# EAGLE design vusb_version (EAGLE 6.5.0)
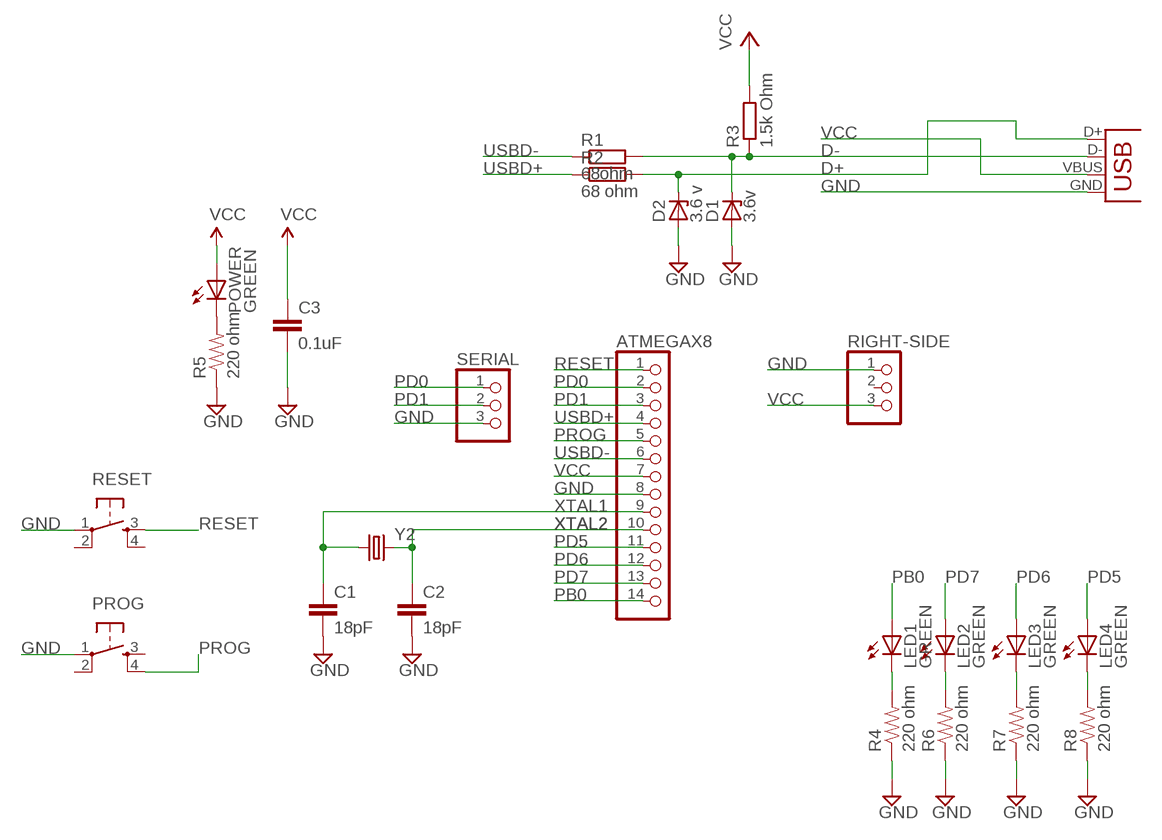
[diagram p0: schematic, sheet 1]

## Parts
ATMEGAX8  PINHD-1X14  [1X14]
C1  18pF  CAP1206  [1206]
C2  18pF  CAP1206  [1206]
C3  0.1uF  CAP1206  [1206]
D1  3.6v  ZENER-DIODESOT23  [SOT23]
D2  3.6 v  ZENER-DIODESOT23  [SOT23]
JP1  USBSMD  [USB-MINIB]
LED1  GREEN  LED-GREENLARGE  [LED-1206]
LED2  GREEN  LED-GREENLARGE  [LED-1206]
LED3  GREEN  LED-GREENLARGE  [LED-1206]
LED4  GREEN  LED-GREENLARGE  [LED-1206]
POWER  GREEN  LED-GREENLARGE  [LED-1206]
PROG  TAC_SWITCHPTH  [TACTILE-PTH]
R1  68ohm  R-EU_R0805  [R0805]
R2  68 ohm  R-EU_R0805  [R0805]
R3  1.5k Ohm  R-EU_R1206  [R1206]
R4  220 ohm  RESISTOR1206  [1206]
R5  220 ohm  RESISTOR1206  [1206]
R6  220 ohm  RESISTOR1206  [1206]
R7  220 ohm  RESISTOR1206  [1206]
R8  220 ohm  RESISTOR1206  [1206]
RESET  TAC_SWITCHPTH  [TACTILE-PTH]
RIGHT-SIDE  PINHD-1X3  [1X03]
SERIAL  PINHD-1X3  [1X03]
Y2  CRYSTALHC49US  [HC49US]

## Nets
D+: D2.3(C) JP1.D+ R2.2
D-: D1.3(C) JP1.D- R1.2 R3.1
GND: ATMEGAX8.8 C1.2 C2.2 C3.2 D1.1(A) D2.1(A) JP1.GND PROG.1 R4.1 R5.1 R6.1 R7.1 R8.1 RESET.1 RIGHT-SIDE.1 SERIAL.3
LED2: LED2.C R6.2
N$1: LED1.C R4.2
N$3: POWER.C R5.2
N$5: LED3.C R7.2
N$6: LED4.C R8.2
N$7: ATMEGAX8.14
PB0: LED1.A
PD0: ATMEGAX8.2 SERIAL.1
PD1: ATMEGAX8.3 SERIAL.2
PD5: ATMEGAX8.11 LED4.A
PD6: ATMEGAX8.12 LED3.A
PD7: ATMEGAX8.13 LED2.A
PROG: ATMEGAX8.5 PROG.4
RESET: ATMEGAX8.1 RESET.3
USBD+: ATMEGAX8.4 R2.1
USBD-: ATMEGAX8.6 R1.1
VCC: ATMEGAX8.7 C3.1 JP1.VBUS POWER.A R3.2 RIGHT-SIDE.3
XTAL1: ATMEGAX8.9 C1.1 Y2.1
XTAL2: ATMEGAX8.10 C2.1 Y2.2
Unconnected: PROG.2 PROG.3 RESET.2 RESET.4 RIGHT-SIDE.2

## Library data of the parts
ATMEGAX8 = pinhead:PINHD-1X14: PIN HEADER
C1-C3 = SparkFun-Capacitors:CAP: Capacitor Standard 0603 ceramic capacitor, and 0.1" leaded capacitor.
D1 D2 = diode:ZENER-DIODE: Z-Diode
JP1 = SparkFun-Connectors:USB: USB Connectors USB-B-PTH is fully proven SKU : PRT-00139/CONN-08278 USB-miniB is fully proven SKU : PRT-00587 USB-A-PCB is untested. USB-A-H is throughly reviewed, but untested. Spark Fun Electronics SKU : PRT-00437 USB-B-SMT is throughly reviewed, but untested. Needs silkscreen touching up. USB-A-S has not been used/tested USB-MB-H has not been used/tested USB-MICROB has been used. CONN-09505; PROD_ID: CONN-08193
LED1-LED4 POWER = SparkFun-LED:LED-GREEN: Various green LEDs 0603- DIO-00821 LARGE- DIO-00862 LILYPAD- DIO-09910; PROD_ID: DIO-00862
PROG RESET = SparkFun-Electromechanical:TAC_SWITCH: Momentary Switch Button commonly used for reset or general input. Spark Fun Electronics SKU : COM-00097 SMT- SWCH-08247
R1-R3 = resistor:R-EU_: RESISTOR, European symbol
R4-R8 = SparkFun-Passives:RESISTOR: Resistor Basic schematic elements and footprints for 0603, 1206, and PTH resistors.
RIGHT-SIDE SERIAL = pinhead:PINHD-1X3: PIN HEADER
Y2 = SparkFun-FreqCtrl:CRYSTAL: Various standard crystals. Proven footprints. Spark Fun Electronics SKU : COM-00534

## Board
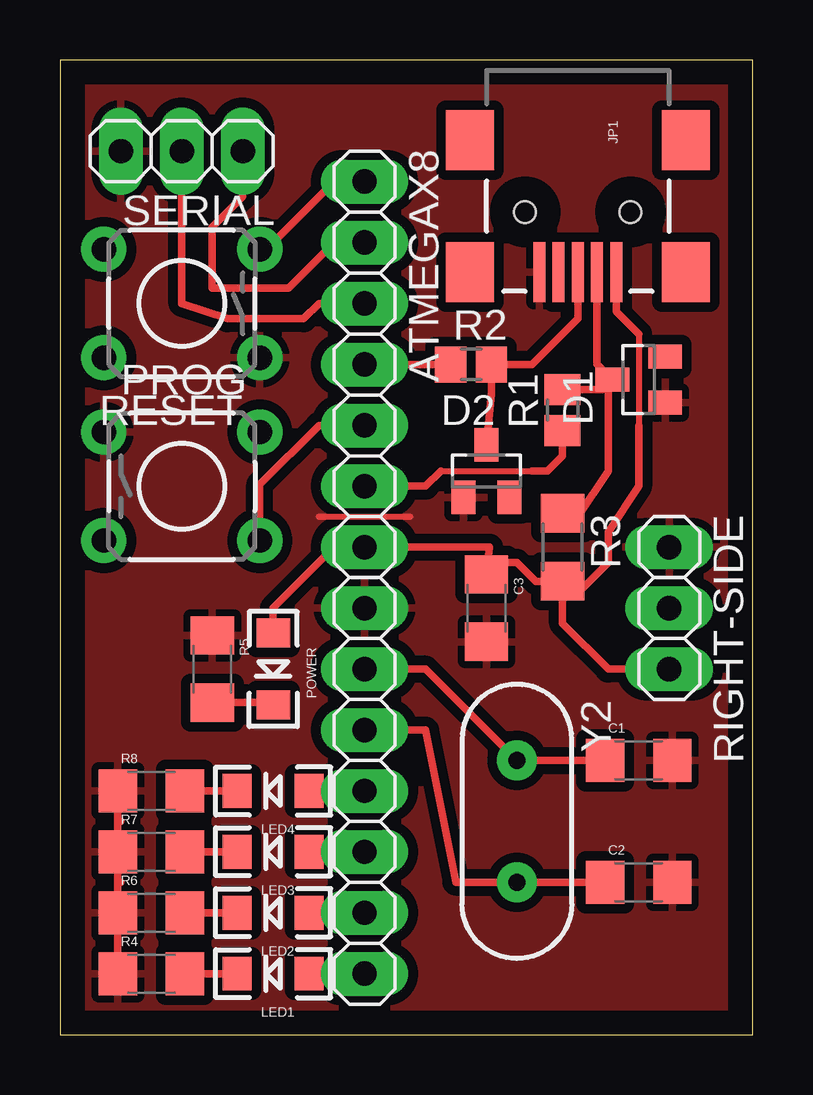
[diagram p1: board, top side]

Size 28.88 x 40.63 mm. Coordinates in mm from the lower left corner, seen from the top.
Outline: 0,0 28.88,0 28.88,40.63 0,40.63 0,0
Copper layers (1*16): Top 0.035mm / dielectric 1.5mm / Bottom 0.035mm
Design rules "improved_12mil": minimum track width 12mil, minimum drill 0.8mm, track to track 12mil, track to pad 12mil, pad to pad 12mil, via to via 12mil, smd to smd 12mil, copper to edge 40mil, drill to drill 12mil, minimum pad ring 16mil, minimum via ring 16mil, stop-mask expansion 4mil, vias tented up to drill 0mil, thermal gap 12mil

### Footprints (pad centres in the part's own frame; a part is rotated, then mirrored left to right if it is on the bottom)
1X14 = drill 1.016 long: 1 -16.51,0; 2 -13.97,0; 3 -11.43,0; 4 -8.89,0; 5 -6.35,0; 6 -3.81,0; 7 -1.27,0; 8 1.27,0; 9 3.81,0; 10 6.35,0; 11 8.89,0; 12 11.43,0; 13 13.97,0; 14 16.51,0
1206 = smd 1.6 x 1.8: 1 -1.4,0; 2 1.4,0
SOT23 = smd 1 x 1.4: 1 -0.95,-1.1; 2 0.95,-1.1; 3 0,1.1
USB-MINIB = smd 2.5 x 0.5: D+ 2.5,0; D- 2.5,0.8; GND 2.5,-1.6; ID 2.5,-0.8; VBUS 2.5,1.6 | smd 2.5 x 2: MTN1 -3,4.5; MTN2 2.5,4.5; MTN3 -3,-4.5; MTN4 2.5,-4.5 | hole 0.9: 0,2.2; 0,-2.2
LED-1206 = smd 1.2 x 1.4: A -1.5,0; C 1.5,0
TACTILE-PTH = drill 1.016 pad 1.88: 1 -3.251,2.261; 2 3.251,2.261; 3 -3.251,-2.261; 4 3.251,-2.261
R0805 = smd 1.3 x 1.5: 1 -0.85,0; 2 0.85,0
R1206 = smd 1.6 x 1.803: 1 -1.422,0; 2 1.422,0
1X03 = drill 1.016 long: 1 -2.54,0; 2 0,0; 3 2.54,0
HC49US = drill 0.7 pad 1.651: 1 -2.54,0; 2 2.54,0

### Placement (x,y rotation side)
ATMEGAX8  12.7,19.05 270 top
C1  24.13,11.43 0 top
C2  24.13,6.35 0 top
C3  17.78,17.78 270 top
D1  24.13,27.3 90 top
D2  17.78,23.49 0 top
JP1  21.59,34.29 270 top
LED1  8.89,2.54 180 top
LED2  8.89,5.08 180 top
LED3  8.89,7.62 180 top
LED4  8.89,10.16 180 top
POWER  8.89,15.24 270 top
PROG  5.08,22.86 0 top
R1  20.95,26.03 90 top
R2  17.14,27.94 0 top
R3  20.95,20.32 270 top
R4  3.81,2.54 0 top
R5  6.35,15.24 270 top
R6  3.81,5.08 0 top
R7  3.81,7.62 0 top
R8  3.81,10.16 0 top
RESET  5.08,30.48 180 top
RIGHT-SIDE  25.4,17.78 270 top
SERIAL  5.08,36.83 180 top
Y2  19.05,8.89 270 top

### Tracks (layer width: path | path; a pad name or v marks a point on that pad's centre or on a via)
D+
  Top 0.305: D2.3 18,26.71 R2.2 19.69,27.94 21.59,29.84 JP1.D+
D-
  Top 0.305: 22.86,27.13 22.86,23.49 21.59,21.59 R3.1 | R1.2 22.61,26.88 22.86,27.13 | 22.86,27.13 D1.3 22.39,27.95 JP1.D-
GND
  Top 0.254: 10.8,21.59 14.61,21.59
  Top 0.305: 2.41,8.89 R8.1 2.54,10.16 2.26,10.01 | 2.41,8.89 R7.1 | R7.1 2.41,6.35 | 2.41,6.35 R6.1 | R6.1 R4.1 | 2.56,5.23 2.54,5.08 R6.1 | 2.54,7.62 2.26,7.47 | 2.54,7.62 2.56,7.77 | 2.54,7.62 R7.1 | 2.54,8.89 2.41,8.89 | 2.54,6.35 2.41,6.35
  pour Top (isolate 0.406): 0,40.64 0,0 29.21,0 29.21,40.64
LED2
  Top 0.305: LED2.C R6.2
N$1
  Top 0.305: LED1.C R4.2
N$3
  Top 0.305: R5.2 8.79,13.84 POWER.C
N$5
  Top 0.305: LED3.C R7.2
N$6
  Top 0.305: LED4.C R8.2
PD0
  Top 0.305: ATMEGAX8.2 11.43,33.02 9.52,31.12 6.35,31.12 6.35,33.66 7.62,34.92 SERIAL.1
PD1
  Top 0.305: ATMEGAX8.3 10.8,30.48 10.16,29.84 6.98,29.84 5.08,30.48 SERIAL.2
PD5
  Top 0.305: ATMEGAX8.11 LED4.A
PD6
  Top 0.305: ATMEGAX8.12 LED3.A
PD7
  Top 0.305: ATMEGAX8.13 LED2.A
PROG
  Top 0.305: PROG.4 8.33,22.94 10.8,25.4 ATMEGAX8.5
RESET
  Top 0.305: ATMEGAX8.1 11.43,35.56 8.89,33.02 RESET.3
USBD+
  Top 0.305: R2.1 ATMEGAX8.4
USBD-
  Top 0.254: 15.88,23.49 19.69,23.49
  Top 0.305: ATMEGAX8.6 15.24,22.86 15.88,23.49 | 19.69,23.49 20.32,23.49 20.95,24.13 R1.1
VCC
  Top 0.254: 24.13,29.21 24.13,25.4
  Top 0.305: 21.59,19.05 R3.2 | R3.2 20.95,17.14 22.86,15.24 RIGHT-SIDE.3 | JP1.VBUS 23.19,30.15 24.13,29.21 | 24.13,25.4 24.13,22.86 22.86,20.95 22.86,19.69 21.59,18.41 21.44,18.41 R3.2 | POWER.A 8.89,17.78 11.43,20.32 ATMEGAX8.7 17.91,20.32 C3.1 17.91,19.69 19.05,19.69 19.84,18.9 R3.2
XTAL1
  Top 0.305: C1.1 Y2.1 15.24,15.24 ATMEGAX8.9
XTAL2
  Top 0.305: ATMEGAX8.10 15.24,12.7 16.51,6.35 Y2.2 C2.1